# Altium schematic sheet Switch.schdoc
size 51 x 28 mm
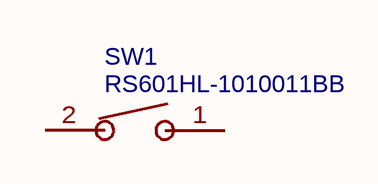
[diagram p0: Switch.schdoc]

## Parts
SW1  RS601HL-1010011BB  [SW-TH_RS601HL-1010011BB]

## Nets

Not connected (* = marked no-connect by the designer): SW1 1 2

## Library data of the parts
SW1 = RS601HL-1010011BB: BOM_Manufacturer: HCTL(华灿天禄); Contributor: lcsc; BOM_Supplier: LCSC; BOM_Supplier Part: C2885782; BOM_Manufacturer Part: RS601HL-1010011BB; link: https://atta.szlcsc.com/upload/public/pdf/source/20210820/B1970E40D09304D7FA648AE2099FB3E8.pdf; BOM_JLCPCB Part Class: Extended Part; spicePre: S; spiceSymbolName: RS601HL-1010011BB